# EAGLE design TestBoard (EAGLE 9.6.2)
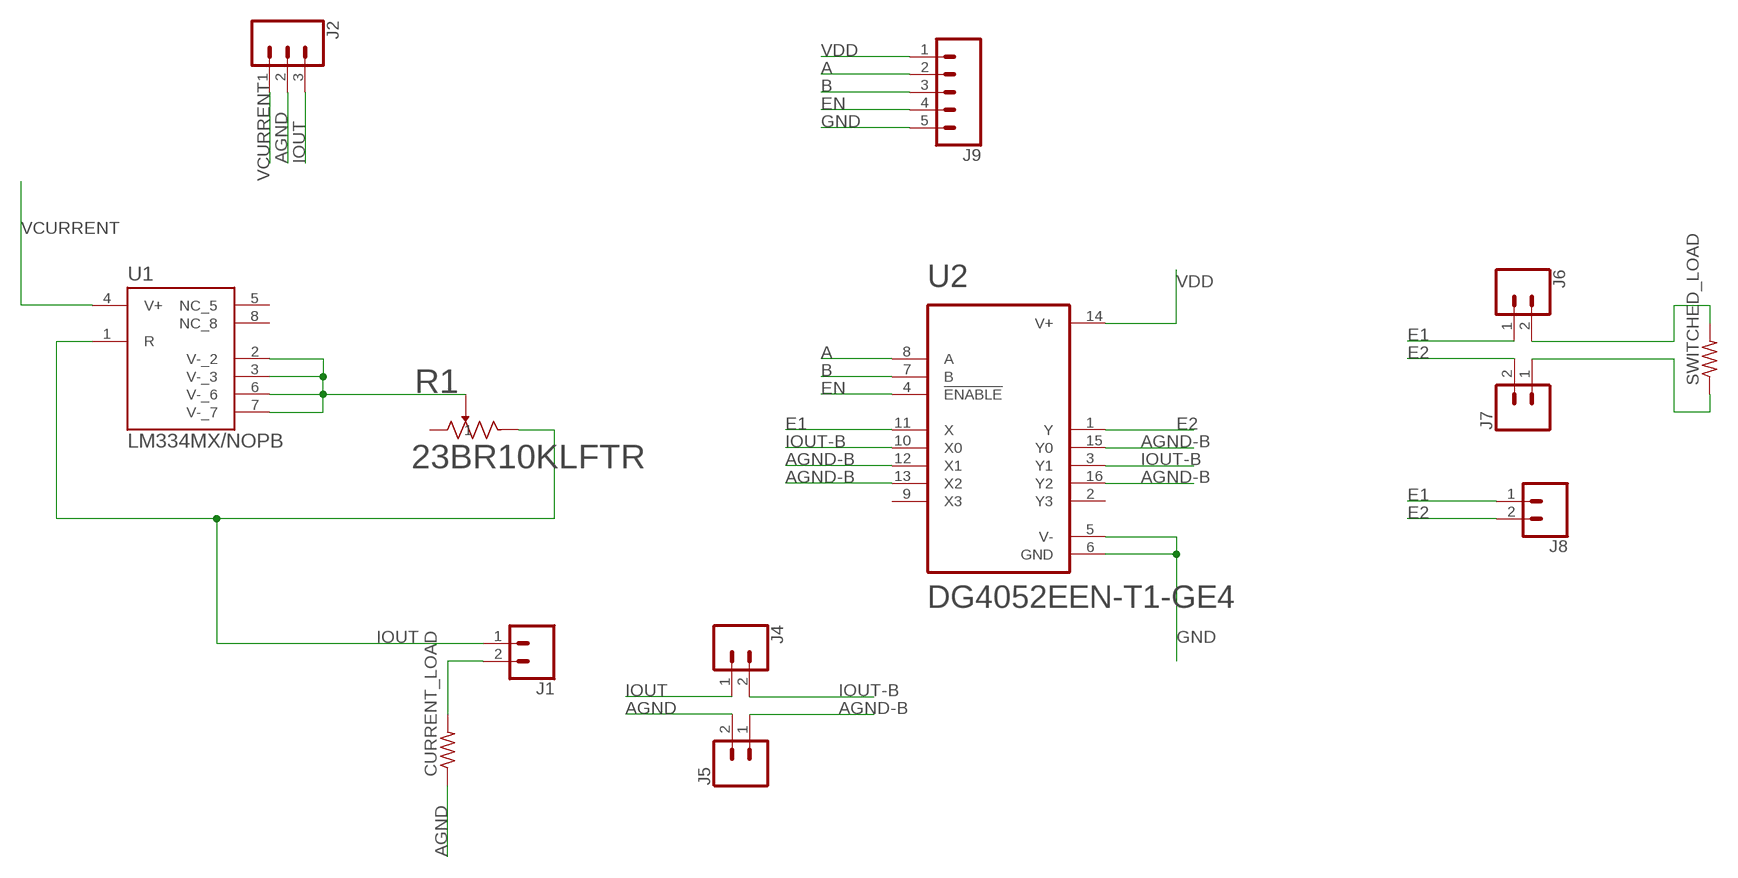
[diagram p0: schematic, sheet 1]

## Parts
CURRENT_LOAD  R-US_V234/12  [V234/12]
J1  CONN_02LOCK  [1X02_LOCK]
J2  CONN_03LOCK  [1X03_LOCK]
J4  CONN_02  [1X02]
J5  CONN_02  [1X02]
J6  CONN_02  [1X02]
J7  CONN_02  [1X02]
J8  CONN_02  [1X02]
J9  CONN_05LOCK  [1X05_LOCK]
R1  23BR10KLFTR  [RES3_23B_TTE]
SWITCHED_LOAD  R-US_V234/12  [V234/12]
U1  LM334MX/NOPB  [SOIC127P599X175-8N]
U2  DG4052EEN-T1-GE4  [QFN40P260X180X60-16N]

## Nets
A: J9.2 U2.8(A)
AGND: CURRENT_LOAD.1 J2.2 J5.2
AGND-B: J5.1 U2.12(X1) U2.13(X2) U2.15(Y0) U2.16(Y2)
B: J9.3 U2.7(B)
E1: J6.1 J8.1 U2.11(X)
E2: J7.2 J8.2 U2.1(Y)
EN: J9.4 U2.4(!ENABLE)
GND: J9.5 U2.5(V-) U2.6(GND)
IOUT: J1.1 J2.3 J4.1 R1.3 U1.1(R)
IOUT-B: J4.2 U2.3(Y1) U2.10(X0)
N$1: J6.2 SWITCHED_LOAD.2
N$2: R1.2 U1.2(V-_2) U1.3(V-_3) U1.6(V-_6) U1.7(V-_7)
N$3: CURRENT_LOAD.2 J1.2
N$4: J7.1 SWITCHED_LOAD.1
VCURRENT: J2.1 U1.4(V+)
VDD: J9.1 U2.14(V+)
Unconnected: R1.1 U1.5(NC_5) U1.8(NC_8) U2.2(Y3) U2.9(X3)

## Library data of the parts
CURRENT_LOAD SWITCHED_LOAD = rcl:R-US_: RESISTOR, American symbol; SPICEPREFIX: R
J1 J4-J8 = SparkFun-Connectors:CONN_02: Multi connection point. Often used as Generic Header-pin footprint for 0.1 inch spaced/style header connections On any of the 0.1 inch spaced packages, you can populate with these: Break Away Headers - Straight <https://www.sparkfun.com/products/116> (PRT-00116) Break Away Male Headers - Right Angle <https://www.sparkfun.com/products/553> (PRT-00553) Female Headers <https://www.sparkfun.com/products/115> (PRT-00115) Break Away Headers - Machine Pin <https://www.sparkfun.com/products/117> (PRT-00117) Break Away Female Headers - Swiss Machine Pin <https://www.sparkfun.com/products/743> (PRT-00743) For SCREWTERMINALS and SPRING TERMINALS visit here: Screw Terimnals on SparkFun.com <https://www.sparkfun.com/search/results?term=Screw+Terminals> (5mm/3.5mm/2.54mm spacing) This device is also useful as a general connection point to wire up your design to another part of your project. Our various solder wires solder well into these plated through hole pads. Hook-Up Wire - Assortment (Stranded, 22 AWG) <https://www.sparkfun.com/products/11375> (PRT-11375) Hook-Up Wire - Assortment (Solid Core, 22 AWG) <https://www.sparkfun.com/products/11367> (PRT-11367) View the entire wire category on our website here <https://www.sparkfun.com/categories/141> Special notes: Molex polarized connector foot print use with: PRT-08233 with associated crimp pins and housings. 2.54_SCREWTERM for use with PRT-10571. 3.5mm Screw Terminal footprints for PRT-08084 5mm Screw Terminal footprints for use with PRT-08432
J2 = SparkFun-Connectors:CONN_03: Multi connection point. Often used as Generic Header-pin footprint for 0.1 inch spaced/style header connections On any of the 0.1 inch spaced packages, you can populate with these: Break Away Headers - Straight <https://www.sparkfun.com/products/116> (PRT-00116) Break Away Male Headers - Right Angle <https://www.sparkfun.com/products/553> (PRT-00553) Female Headers <https://www.sparkfun.com/products/115> (PRT-00115) Break Away Headers - Machine Pin <https://www.sparkfun.com/products/117> (PRT-00117) Break Away Female Headers - Swiss Machine Pin <https://www.sparkfun.com/products/743> (PRT-00743) Stackable Header - 3 Pin (Female, 0.1") <https://www.sparkfun.com/products/13875> (PRT-13875) For SCREWTERMINALS and SPRING TERMINALS visit here: Screw Terimnals on SparkFun.com <https://www.sparkfun.com/search/results?term=Screw+Terminals> (5mm/3.5mm/2.54mm spacing) This device is also useful as a general connection point to wire up your design to another part of your project. Our various solder wires solder well into these plated through hole pads. Hook-Up Wire - Assortment (Stranded, 22 AWG) <https://www.sparkfun.com/products/11375> (PRT-11375) Hook-Up Wire - Assortment (Solid Core, 22 AWG) <https://www.sparkfun.com/products/11367> (PRT-11367) View the entire wire category on our website here <https://www.sparkfun.com/categories/141> Special notes: Molex polarized connector foot print use with SKU : PRT-08232 with associated crimp pins and housings.
J9 = SparkFun-Connectors:CONN_05: Multi connection point. Often used as Generic Header-pin footprint for 0.1 inch spaced/style header connections On any of the 0.1 inch spaced packages, you can populate with these: Break Away Headers - Straight <https://www.sparkfun.com/products/116> (PRT-00116) Break Away Male Headers - Right Angle <https://www.sparkfun.com/products/553> (PRT-00553) Female Headers <https://www.sparkfun.com/products/115> (PRT-00115) Break Away Headers - Machine Pin <https://www.sparkfun.com/products/117> (PRT-00117) Break Away Female Headers - Swiss Machine Pin <https://www.sparkfun.com/products/743> (PRT-00743) For SCREWTERMINALS and SPRING TERMINALS visit here: Screw Terimnals on SparkFun.com <https://www.sparkfun.com/search/results?term=Screw+Terminals> (5mm/3.5mm/2.54mm spacing) This device is also useful as a general connection point to wire up your design to another part of your project. Our various solder wires solder well into these plated through hole pads. Hook-Up Wire - Assortment (Stranded, 22 AWG) <https://www.sparkfun.com/products/11375> (PRT-11375) Hook-Up Wire - Assortment (Solid Core, 22 AWG) <https://www.sparkfun.com/products/11367> (PRT-11367) View the entire wire category on our website here <https://www.sparkfun.com/categories/141> Special notes: Molex polarized connector foot print use with SKU : PRT-08231 with associated crimp pins and housings. 1MM SMD Version SKU: PRT-10208
R1 = trimmer:23BR10KLFTR; COPYRIGHT: Copyright (C) 2016 Accelerated Designs. All rights reserved; MANUFACTURER_PART_NUMBER: 23BR10KLFTR; SOURCELIBRARY: TTELECTRONICS_2018-04-11; VENDOR: TT Electronics
U1 = LM334MX_NOPB:LM334MX/NOPB: 0C to 70C 3-pin adjustable current source 8-SOIC 0 to 70; DESCRIPTION: 0C to 70C 3-pin adjustable current source 8-SOIC 0 to 70; DIGI-KEY_PART_NUMBER: LM334MX/NOPBCT-ND; MF: Texas Instruments; MP: LM334MX/NOPB; PACKAGE: SOIC-8 Texas Instruments; PURCHASE-URL: https://pricing.snapeda.com/search/part/LM334MX/NOPB/?ref=eda
U2 = DG4052EEN-T1-GE4:DG4052EEN-T1-GE4: DG4052E Series 16 V 78 Ohm High Precision CMOS Analog Multiplexer - miniQFN-16; DESCRIPTION: 2 Circuit IC Switch 4:1 78Ohm 16-miniQFN (1.8x2.6); DIGI-KEY_PART_NUMBER: DG4052EEN-T1-GE4CT-ND; MF: Vishay; MP: DG4052EEN-T1-GE4; PACKAGE: WFQFN-16 Vishay; PURCHASE-URL: https://pricing.snapeda.com/search/part/DG4052EEN-T1-GE4/?ref=eda

## Board
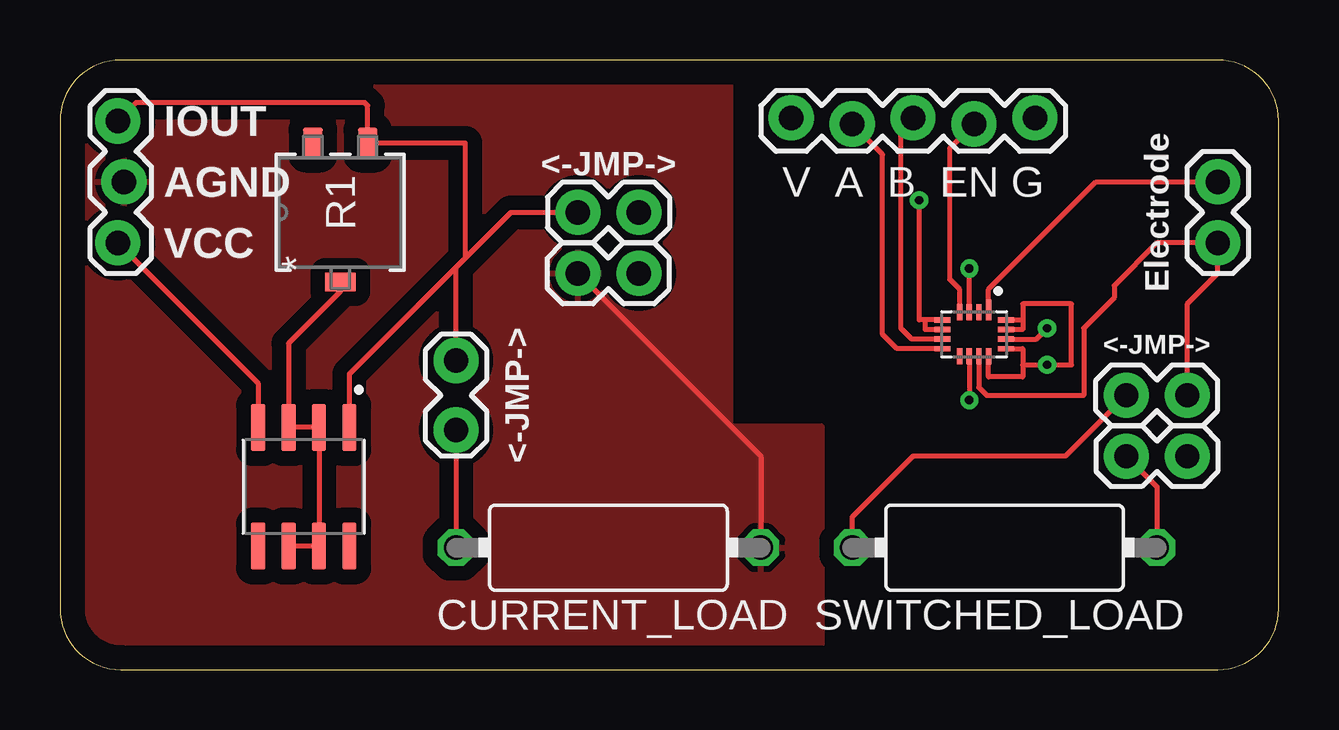
[diagram p1: board, top side]
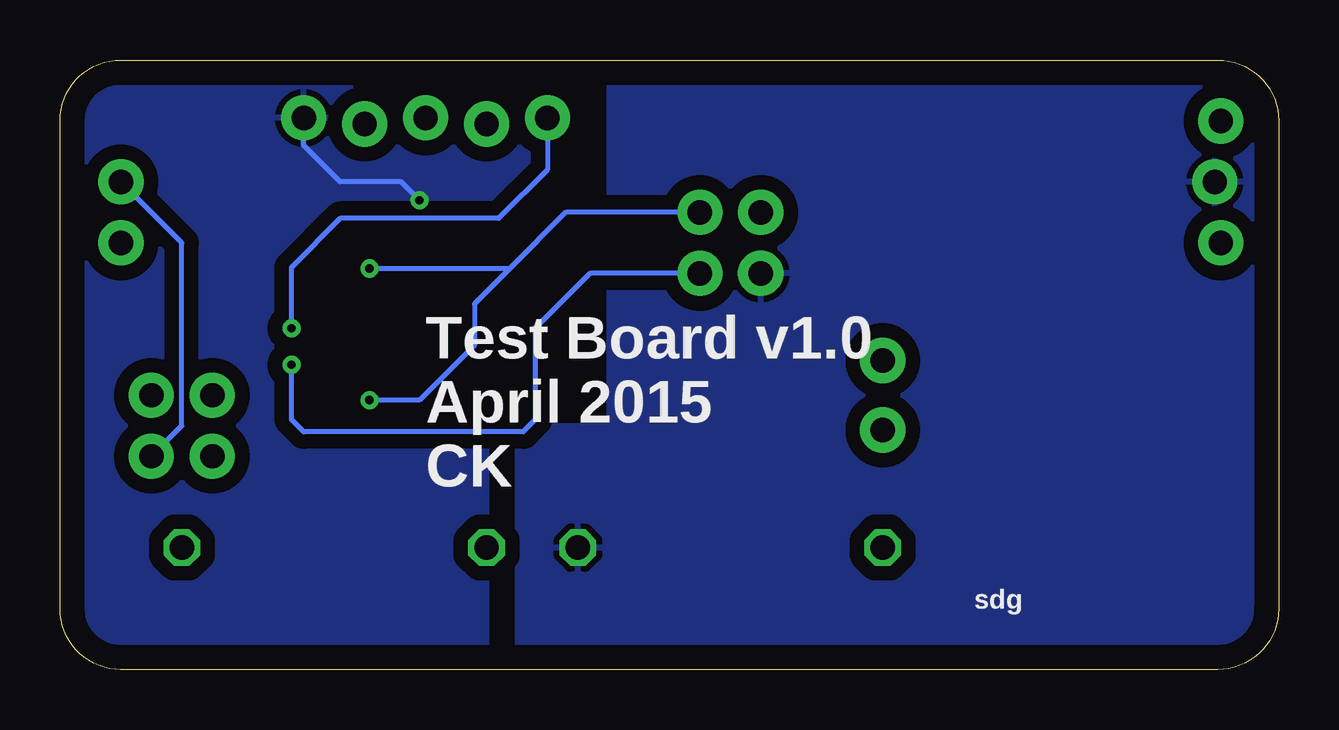
[diagram p2: board, bottom side, seen from below]

Size 50.8 x 25.4 mm. Coordinates in mm from the lower left corner, seen from the top.
Outline: 0,22.86 0,2.54 arc90 2.54,0 48.26,0 arc90 50.8,2.54 50.8,22.86 arc90 48.26,25.4 2.54,25.4 arc90 0,22.86
Copper layers (1*16): Top 0.035mm / dielectric 1.5mm / Bottom 0.035mm
Design rules "default": minimum track width 6mil, minimum drill 0.35mm, track to track 6mil, track to pad 6mil, pad to pad 6mil, via to via 6mil, smd to smd 6mil, copper to edge 40mil, drill to drill 6mil, minimum pad ring 10mil, minimum via ring 8mil, stop-mask expansion 4mil, vias tented up to drill 0mil, thermal gap 10mil

### Footprints (pad centres in the part's own frame; a part is rotated, then mirrored left to right if it is on the bottom)
V234/12 = drill 1.016 octagon: 1 -6.35,0; 2 6.35,0
1X02_LOCK = drill 1.016 pad 1.88: 1 -0.178,0; 2 2.718,0
1X03_LOCK = drill 1.016 pad 1.88: 1 0,0.127; 2 2.54,-0.127; 3 5.08,0.127
1X02 = drill 1.016 pad 1.88: 1 0,0; 2 2.54,0
1X05_LOCK = drill 1.016 pad 1.88: 1 0,0.127; 2 2.54,-0.127; 3 5.08,0.127; 4 7.62,-0.127; 5 10.16,0.127
RES3_23B_TTE = smd 1.27 x 0.813: 1 2.896,1.143; 3 2.896,-1.143 | smd 0.762 x 1.27: 2 -2.896,0
SOIC127P599X175-8N = smd 1.97 x 0.6: 1 -2.47,1.905; 2 -2.47,0.635; 3 -2.47,-0.635; 4 -2.47,-1.905; 5 2.47,-1.905; 6 2.47,-0.635; 7 2.47,0.635; 8 2.47,1.905
QFN40P260X180X60-16N = smd 0.863 x 0.225: 1 -1.018,0.6 | smd 0.663 x 0.225: 2 -0.918,0.2; 3 -0.918,-0.2; 4 -0.918,-0.6; 9 0.918,-0.6; 10 0.918,-0.2; 11 0.918,0.2; 12 0.918,0.6 | smd 0.225 x 0.663: 5 -0.6,-1.319; 6 -0.2,-1.319; 7 0.2,-1.319; 8 0.6,-1.319; 13 0.6,1.319; 14 0.2,1.319; 15 -0.2,1.319; 16 -0.6,1.319

### Placement (x,y rotation side)
CURRENT_LOAD  22.86,5.08 180 top
J1  16.51,12.7 270 top
J2  2.54,17.78 90 top
J4  21.59,19.05 0 top
J5  24.13,16.51 180 top
J6  46.99,11.43 180 top
J7  44.45,8.89 0 top
J8  48.26,17.78 90 top
J9  30.48,22.86 0 top
R1  11.68,19.05 90 top
SWITCHED_LOAD  39.37,5.08 180 top
U1  10.16,7.62 270 top
U2  38.1,13.97 270 top

### Tracks (layer width: path | path; a pad name or v marks a point on that pad's centre or on a via)
A
  Top 0.203: U2.8 34.89,13.37 34.29,13.97 34.29,21.46 J9.2
AGND
  Top 0.203: J5.2 29.21,8.89 CURRENT_LOAD.1
  pour Top (isolate 0.61): 0,25.4 27.94,25.4 27.94,10.16 31.75,10.16 31.75,0 0,0
  pour Bottom (isolate 0.61): 0,25.4 27.94,25.4 27.94,10.16 31.75,10.16 31.75,0 0,0
AGND-B  (via drill 0.35)
  Top 0.203: U2.16 40.13,14.57 | U2.15 40.13,14.17 40.13,14.57 | U2.13 40.13,13.37 40.13,12.7 | U2.12 38.7,12.19 40.13,12.19 40.13,12.7 | 40.13,12.7 v41.15,12.7 42.16,12.7 42.16,15.24 40.13,15.24 40.13,14.57
  Bottom 0.203: J5.1 28.7,16.51 30.99,14.22 30.99,10.41 31.5,9.91 40.64,9.91 41.15,10.41 v41.15,12.7
B
  Top 0.203: U2.7 35.51,13.77 35.05,14.22 35.05,22.48 J9.3
E1
  Top 0.203: J6.1 46.99,15.24 48.26,16.51 J8.1 45.72,17.78 43.94,16 43.94,15.49 42.67,14.22 42.67,11.43 38.63,11.43 38.3,11.76 U2.11
E2
  Top 0.203: U2.1 38.7,15.84 43.18,20.32 J8.2
  Bottom 0.203: J7.2 45.72,10.16 45.72,17.78 J8.2
EN
  Top 0.203: U2.4 37.5,15.84 37.08,16.26 37.08,21.72 J9.4
GND  (via drill 0.35)
  Top 0.203: U2.6 36.07,14.17 36.07,14.57 | U2.5 36.07,14.57 | 36.07,14.57 35.81,14.57 v35.81,19.56
  Bottom 0.203: v35.81,19.56 36.58,20.32 39.12,20.32 40.64,21.84 J9.5
  pour Bottom (isolate 0.61): 29.21,25.4 29.21,11.43 33.02,11.43 33.02,0 50.8,0 50.8,1.27 50.8,25.4
IOUT
  Top 0.203: J1.1 16.51,16.76 | J4.1 18.8,19.05 16.89,17.14 | U1.1 12.06,12.32 16.51,16.76 | 16.51,16.76 16.89,17.14 | J2.3 3.17,23.62 12.7,23.62 12.83,23.5 R1.3 16.89,21.95 16.89,17.14
IOUT-B  (via drill 0.35)
  Top 0.203: U2.10 v37.9,11.23 | U2.3 v37.9,16.71
  Bottom 0.203: v37.9,11.23 35.81,11.23 33.53,13.52 33.53,15.24 32.06,16.71 | J4.2 29.72,19.05 32.06,16.71 | 32.06,16.71 v37.9,16.71
N$1
  Top 0.203: J6.2 41.91,8.89 35.56,8.89 33.02,6.35 SWITCHED_LOAD.2
N$2
  Top 0.203: U1.6 U1.7 U1.2 U1.3 9.53,13.59 11.68,15.75 R1.2
N$3
  Top 0.203: J1.2 CURRENT_LOAD.2
N$4
  Top 0.203: J7.1 45.72,7.62 SWITCHED_LOAD.1
VCURRENT
  Top 0.203: J2.1 8.26,11.94 U1.4
VDD  (via drill 0.35)
  Top 0.203: U2.14 40.69,13.77 v41.15,14.22
  Bottom 0.203: v41.15,14.22 41.15,16.76 39.12,18.8 32.51,18.8 30.48,20.83 J9.1

### Text on the board
tPlace: <-JMP-> | IOUT / AGND / VCC | V A B EN G | Electrode | <-JMP-> | <-JMP->
bPlace: Test Board v1.0 / April 2015 / CK | sdg